# Altium schematic sheet STM32-Flasher.SchDoc
size A4; Author: 符观辉; DrawnBy: 符观辉
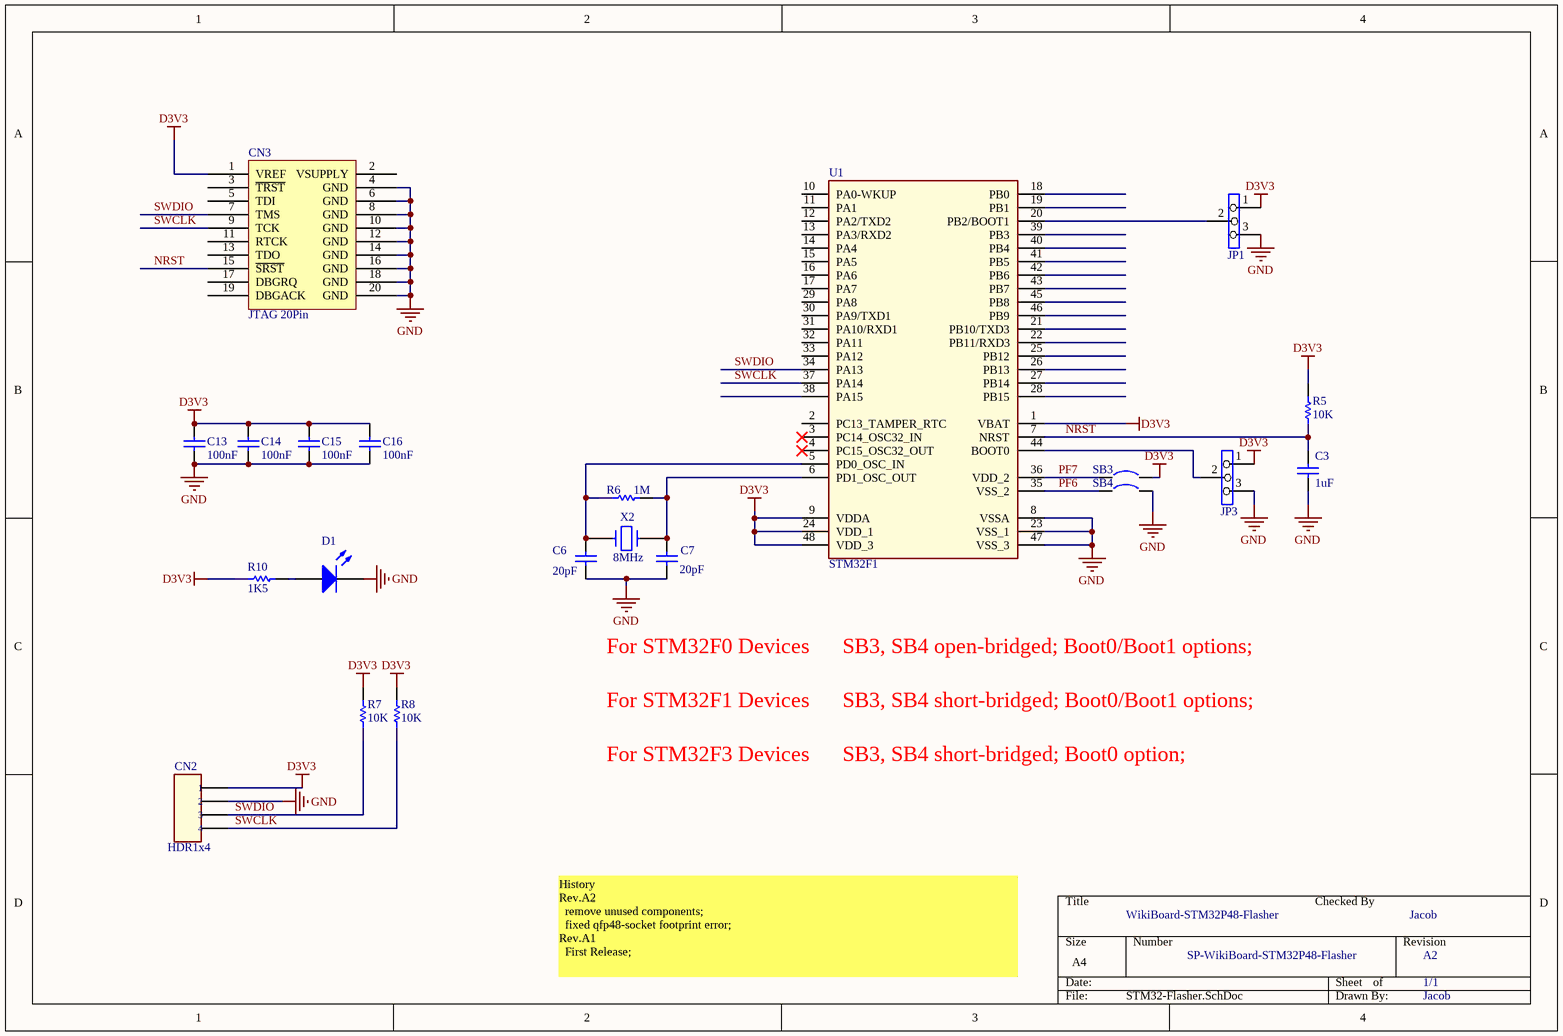
[diagram p0: STM32-Flasher.SchDoc]

## Parts
C3  value 1uF  [C0603L]  (hidden comment: Cap)
C6  value 20pF  [C0603L]  (hidden comment: Cap)
C7  value 20pF  [C0603L]  (hidden comment: Cap)
C13  value 100nF  [C0603L]  (hidden comment: Cap)
C14  value 100nF  [C0603L]  (hidden comment: Cap)
C15  value 100nF  [C0603L]  (hidden comment: Cap)
C16  value 100nF  [C0603L]  (hidden comment: Cap)
CN2  HDR1x4  [HDR1x4]
CN3  JTAG 20Pin  [DC3/20P/2.54mm]
D1  LED1  [0603pn]  (value not drawn)
JP1  Jumper3  [HDR1X3/2.54MM]  (value not drawn)
JP3  Jumper3  [HDR1X3/2.54MM]  (value not drawn)
R5  10K  [R0603]
R6  1M  [R0603]
R7  10K  [R0603]
R8  10K  [R0603]
R10  1K5  [R0603]
SB3  Circuit Breaker  [HDR1X2/2.54mm]  (value not drawn)
SB4  Circuit Breaker  [HDR1X2/2.54mm]  (value not drawn)
U1  STM32F1  [QFP48-Socket]
X2  8MHz  [XTAL_socket]

## Nets
D3V3: C13.2 C14.2 C15.2 C16.2 CN2.1 CN3.1(VREF) JP1.1 JP3.1 R5.2 R7.2 R8.2 R10.1 SB3.2 U1.1(VBAT) U1.9(VDDA) U1.24(VDD_1) U1.48(VDD_3)
GND: C3.1 C6.1 C7.1 C13.1 C14.1 C15.1 C16.1 CN2.2 CN3.4(GND) CN3.6(GND) CN3.8(GND) CN3.10(GND) CN3.12(GND) CN3.14(GND) CN3.16(GND) CN3.18(GND) CN3.20(GND) D1.2(K) JP1.3 JP3.3 SB4.2 U1.8(VSSA) U1.23(VSS_1) U1.47(VSS_3)
NRST: C3.2 CN3.15(~{SRST}) R5.1 U1.7(NRST)
PF6: SB4.1 U1.35(VSS_2)
PF7: SB3.1 U1.36(VDD_2)
SWCLK: CN2.4 CN3.9(TCK) R8.1 U1.37(PA14)
SWDIO: CN2.3 CN3.7(TMS) R7.1 U1.34(PA13)
NetC6_2: C6.2 R6.1 U1.5(PD0_OSC_IN) X2.2
NetC7_2: C7.2 R6.2 U1.6(PD1_OSC_OUT) X2.1
NetD1_1: D1.1(A) R10.2
NetJP1_2: JP1.2 U1.20(PB2/BOOT1)
NetJP3_2: JP3.2 U1.44(BOOT0)

Not connected (* = marked no-connect by the designer): CN3 2(VSUPPLY) 3(~{TRST}) 5(TDI) 11(RTCK) 13(TDO) 17(DBGRQ) 19(DBGACK); U1 2(PC13_TAMPER_RTC) 3(PC14_OSC32_IN)* 4(PC15_OSC32_OUT)* 10(PA0-WKUP) 11(PA1) 12(PA2/TXD2) 13(PA3/RXD2) 14(PA4) 15(PA5) 16(PA6) 17(PA7) 18(PB0) 19(PB1) 21(PB10/TXD3) 22(PB11/RXD3) 25(PB12) 26(PB13) 27(PB14) 28(PB15) 29(PA8) 30(PA9/TXD1) 31(PA10/RXD1) 32(PA11) 33(PA12) 38(PA15) 39(PB3) 40(PB4) 41(PB5) 42(PB6) 43(PB7) 45(PB8) 46(PB9)

## Notes on the sheet
- For STM32F0 Devices      SB3, SB4 open-bridged; Boot0/Boot1 options;
- For STM32F1 Devices      SB3, SB4 short-bridged; Boot0/Boot1 options;
- For STM32F3 Devices      SB3, SB4 short-bridged; Boot0 option;
- WikiBoard-STM32P48-Flasher
- Checked By
- Jacob
- History
  Rev.A2
  remove unused components;
  fixed qfp48-socket footprint error;
  Rev.A1
  First Release;
- SP-WikiBoard-STM32P48-Flasher
- A2
- 1/1

## Library data of the parts
C3 C6 C7 C13-C16 = Cap: Capacitor; Published: 8-Jun-2000; LatestRevisionDate: 17-Jul-2002; LatestRevisionNote: Re-released for DXP Platform.; PackageReference: RAD-0.3; Publisher: Altium Limited
CN2 = CON4
CN3 = JTAG 20Pin: 20Pin JTAG CONNECTOR
D1 = LED1: Typical RED GaAs LED; Published: 8-Jun-2000; LatestRevisionDate: 08-Jul-2005; LatestRevisionNote: Mech Layer 1 removed.; PackageReference: LED-1; Publisher: Altium Limited
R5-R8 R10 = RES: Resistor; Design Item Id: RES-50R-1%-0805
SB3 SB4 = Circuit Breaker: Solder: YES; Published: 24-Mar-1999; Revision: July-2002: Re-released for DXP Platform.; Publisher: Altium Limited
U1 = STM32F103CxT: Cortex M3, 48-pin LQFP
X2 = CRYSTAL